# Altium schematic sheet PROC054D_AWR_1_AWR_4_LP87524P.SchDoc: AWR_1_AWR_4_LP87524P
size 558 x 431 mm; Date: Not shown in title block; ApprovedBy: Not shown in title block; CheckedBy: Not shown in title block; Author: Not shown in title block; CompanyName: Not shown in title block; DrawnBy: a0271760; Engineer: Not shown in title block; Organization: Not shown in title block; Address1: Not shown in title block; Address2: Not shown in title block; Address3: Not shown in title block; Address4: Not shown in title block; DocumentNumber: 4; Revision: Use project pAWRameter SCH_Rev; SheetNumber: 4; SheetTotal: 19; PageSetup: Record=PageOptions|CenterHorizontal=True|CenterVertical=True|PrintScale=1.00|XCorrection=1.00|YCorrection=1.00|PrintKind=0|BorderSize=5000000|LeftOffset=0|BottomOffset=0|Orientation=2|PaperLength=1000|PaperWidth=1000|Scale=100|PaperSource=15|PrintQuality=600|MediaType=1|DitherType=10|PaperKind=Letter|PrintScaleMode=1; CurrentTime: Not shown in title block; CurrentDate: Not shown in title block; Time: Not shown in title block; DocumentFullPathAndName: Not shown in title block; DocumentName: Not shown in title block; ModifiedDate: Not shown in title block; ImagePath: Not shown in title block
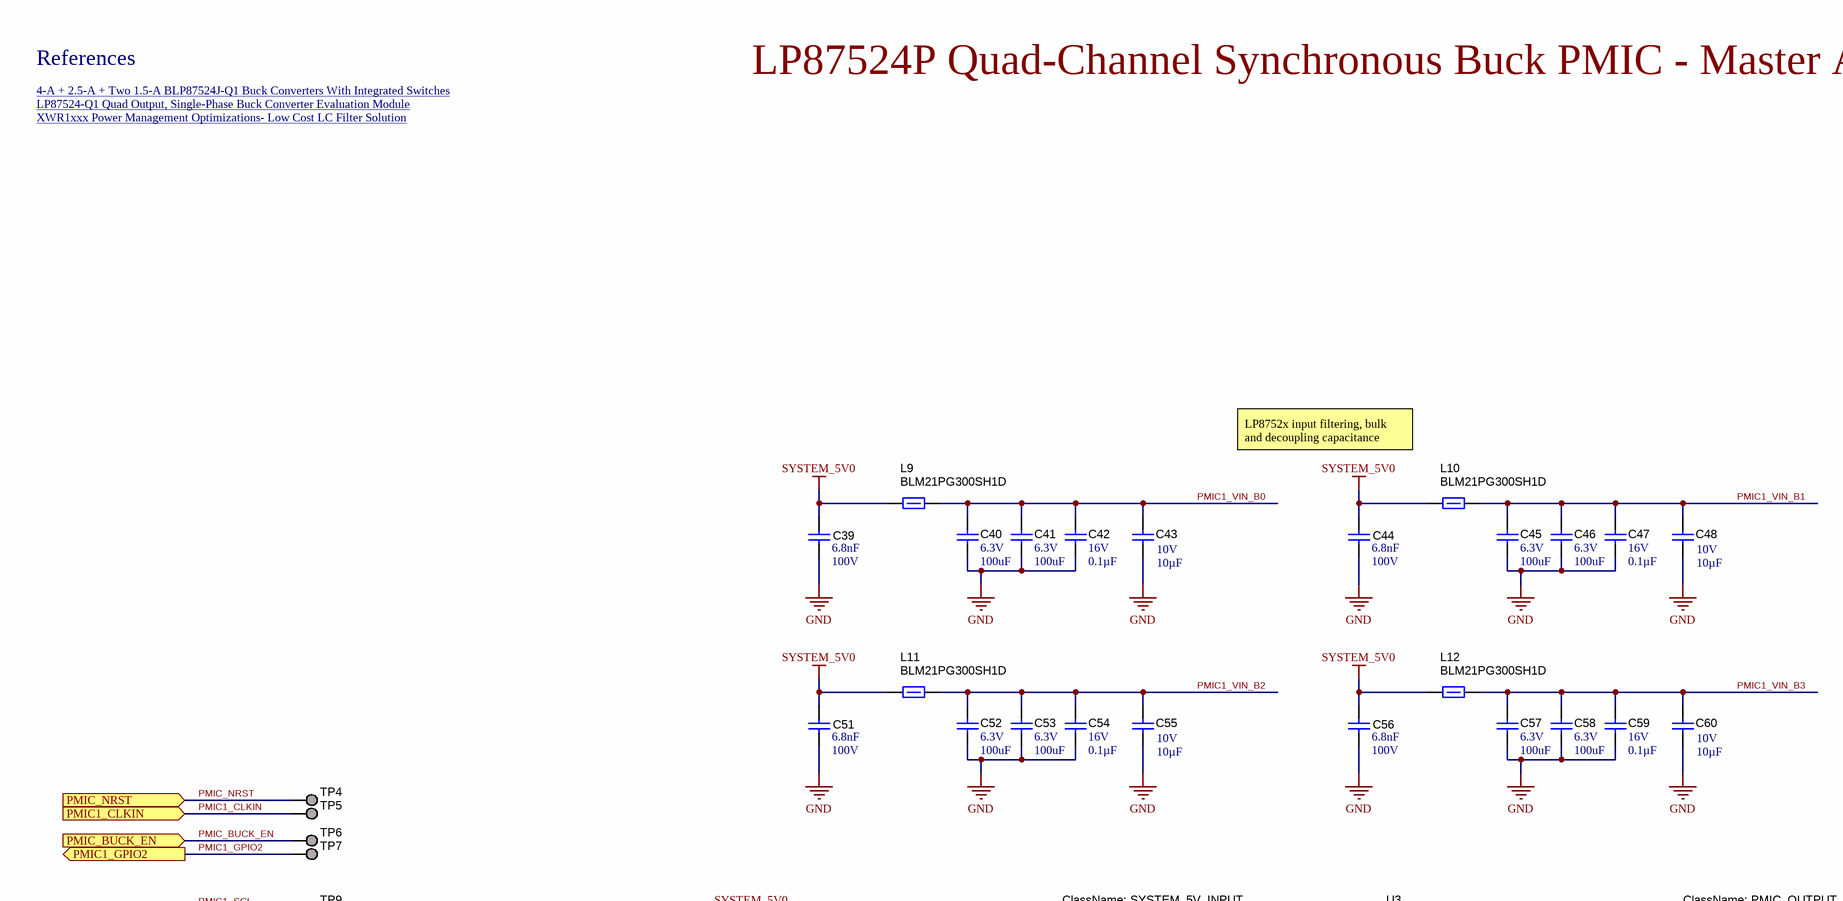
[diagram p0: PROC054D_AWR_1_AWR_4_LP87524P.SchDoc, top left]
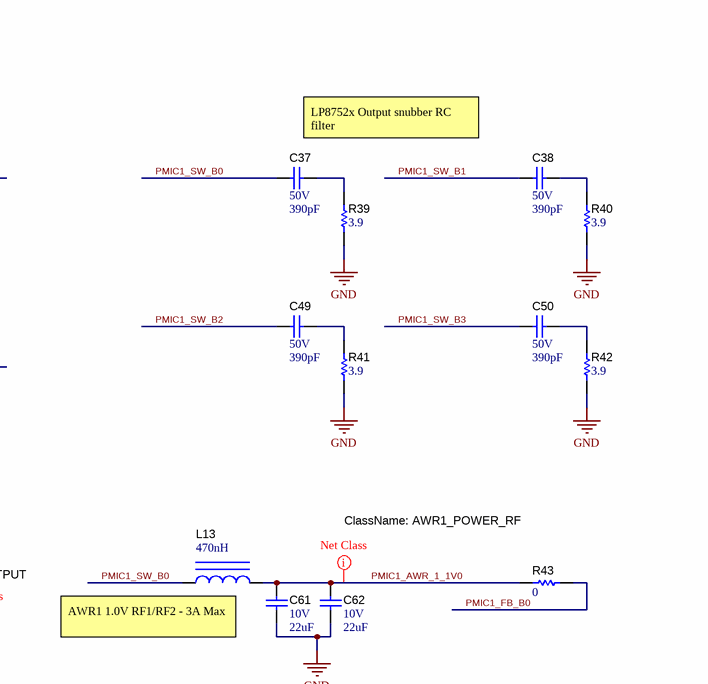
[diagram p1: PROC054D_AWR_1_AWR_4_LP87524P.SchDoc, top right]
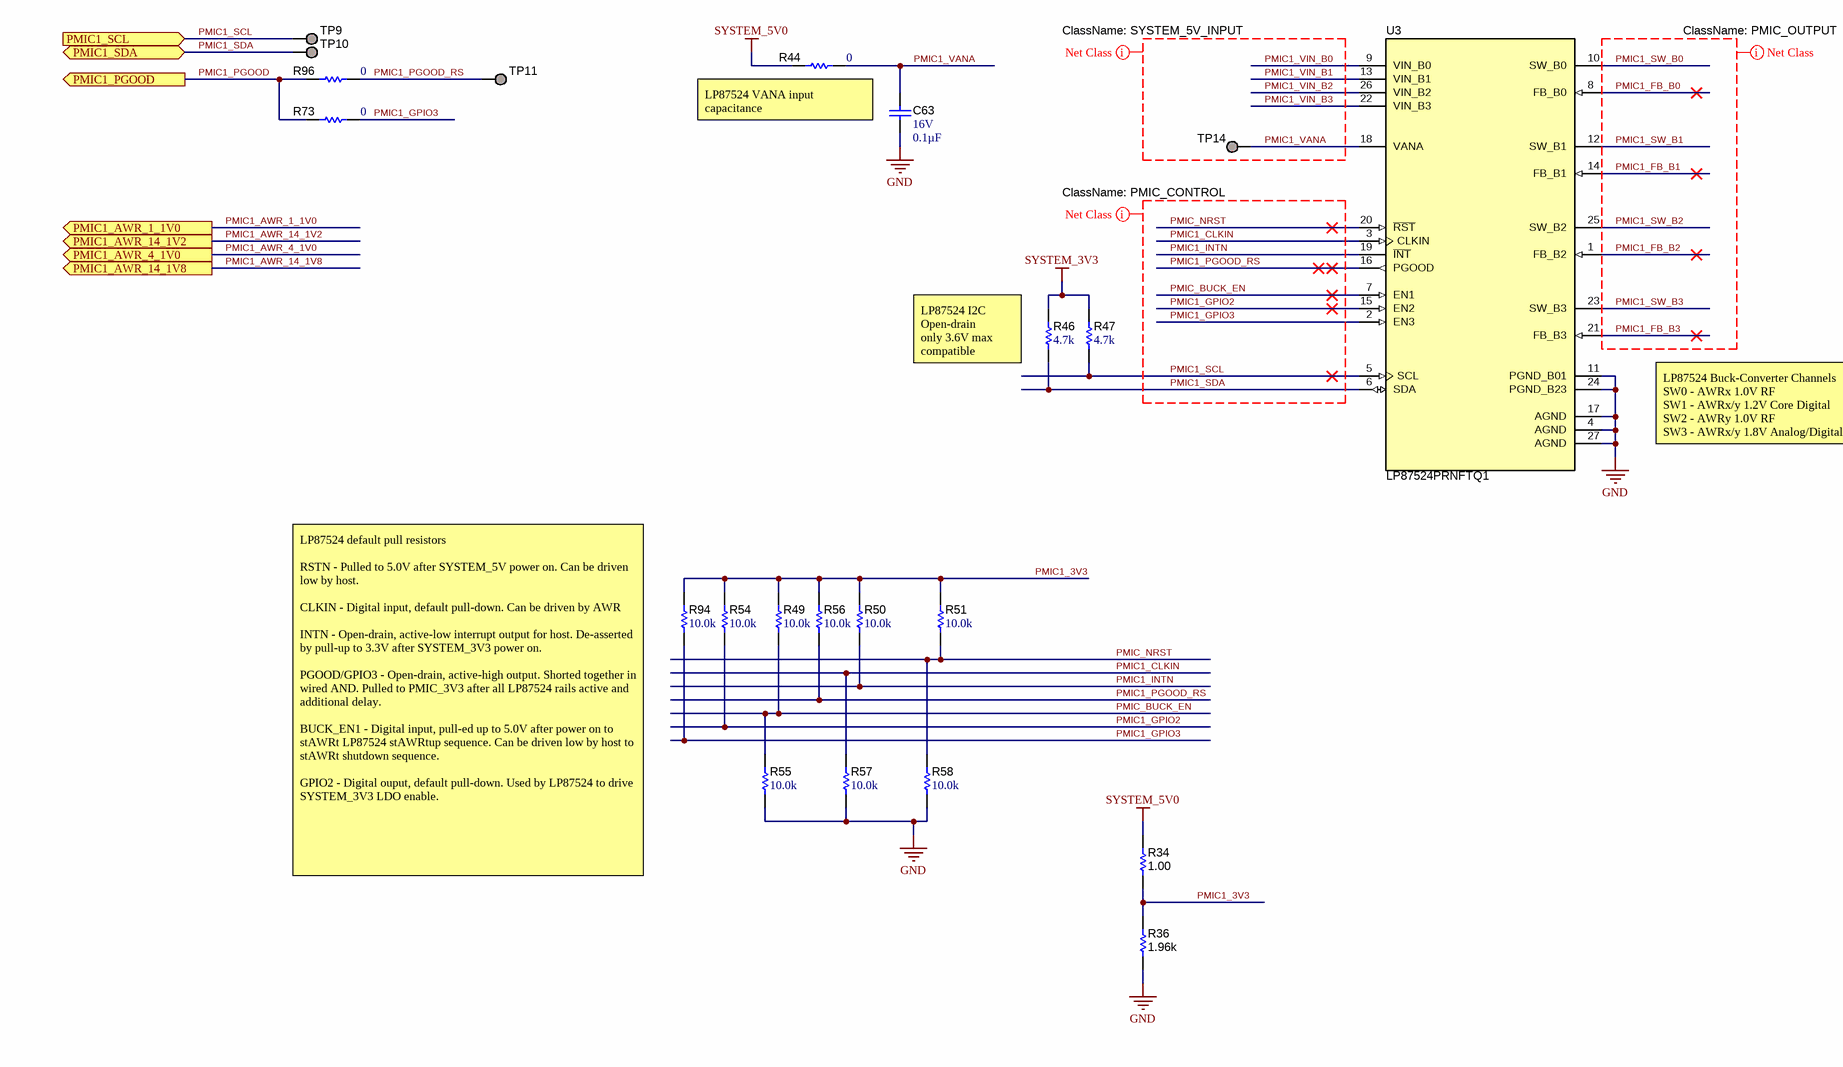
[diagram p2: PROC054D_AWR_1_AWR_4_LP87524P.SchDoc, bottom left]
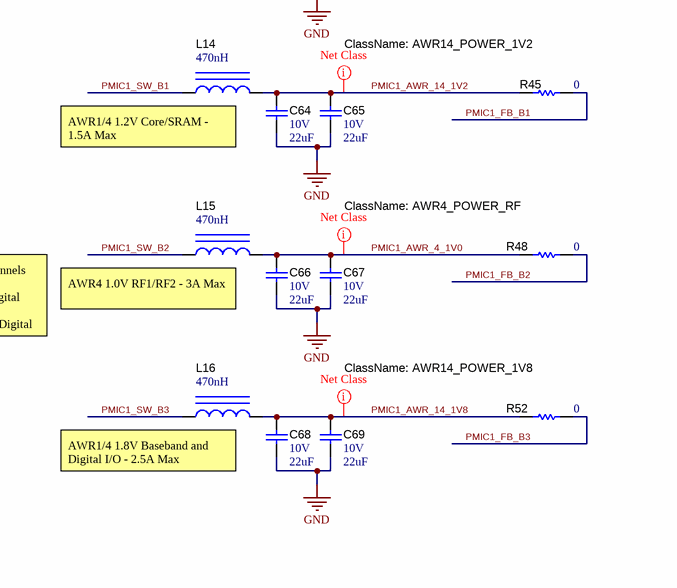
[diagram p3: PROC054D_AWR_1_AWR_4_LP87524P.SchDoc, bottom right]

## Parts
C37  VDC_V: 50V  ValueDisplayed: 390pF  [0402S]  (hidden comment: GCM155R71H391KA37D)
C38  VDC_V: 50V  ValueDisplayed: 390pF  [0402S]  (hidden comment: GCM155R71H391KA37D)
C39  Cap_F: 6.8nF  VDC_V: 100V  [0603S]  (hidden comment: GCM188R72A682KA37D)
C40  VDC_V: 6.3V  ValueDisplayed: 100uF  [0805L]  (hidden comment: GRM21BR60J107M)
C41  VDC_V: 6.3V  ValueDisplayed: 100uF  [0805L]  (hidden comment: GRM21BR60J107M)
C42  VDC_V: 16V  ValueDisplayed: 0.1µF  [0402S]  (hidden comment: GCM155R71C104JA55D)
C43  Cap_F: 10µF  VDC_V: 10V  [0805L]  (hidden comment: GRM21BR71A106KA73L)
C44  Cap_F: 6.8nF  VDC_V: 100V  [0603S]  (hidden comment: GCM188R72A682KA37D)
C45  VDC_V: 6.3V  ValueDisplayed: 100uF  [0805L]  (hidden comment: GRM21BR60J107M)
C46  VDC_V: 6.3V  ValueDisplayed: 100uF  [0805L]  (hidden comment: GRM21BR60J107M)
C47  VDC_V: 16V  ValueDisplayed: 0.1µF  [0402S]  (hidden comment: GCM155R71C104JA55D)
C48  Cap_F: 10µF  VDC_V: 10V  [0805L]  (hidden comment: GRM21BR71A106KA73L)
C49  VDC_V: 50V  ValueDisplayed: 390pF  [0402S]  (hidden comment: GCM155R71H391KA37D)
C50  VDC_V: 50V  ValueDisplayed: 390pF  [0402S]  (hidden comment: GCM155R71H391KA37D)
C51  Cap_F: 6.8nF  VDC_V: 100V  [0603S]  (hidden comment: GCM188R72A682KA37D)
C52  VDC_V: 6.3V  ValueDisplayed: 100uF  [0805L]  (hidden comment: GRM21BR60J107M)
C53  VDC_V: 6.3V  ValueDisplayed: 100uF  [0805L]  (hidden comment: GRM21BR60J107M)
C54  VDC_V: 16V  ValueDisplayed: 0.1µF  [0402S]  (hidden comment: GCM155R71C104JA55D)
C55  Cap_F: 10µF  VDC_V: 10V  [0805L]  (hidden comment: GRM21BR71A106KA73L)
C56  Cap_F: 6.8nF  VDC_V: 100V  [0603S]  (hidden comment: GCM188R72A682KA37D)
C57  VDC_V: 6.3V  ValueDisplayed: 100uF  [0805L]  (hidden comment: GRM21BR60J107M)
C58  VDC_V: 6.3V  ValueDisplayed: 100uF  [0805L]  (hidden comment: GRM21BR60J107M)
C59  VDC_V: 16V  ValueDisplayed: 0.1µF  [0402S]  (hidden comment: GCM155R71C104JA55D)
C60  Cap_F: 10µF  VDC_V: 10V  [0805L]  (hidden comment: GRM21BR71A106KA73L)
C61  VDC_V: 10V  ValueDisplayed: 22uF  [0805L]  (hidden comment: C2012X7S1A226M125AC)
C62  VDC_V: 10V  ValueDisplayed: 22uF  [0805L]  (hidden comment: C2012X7S1A226M125AC)
C63  VDC_V: 16V  ValueDisplayed: 0.1µF  [0402S]  (hidden comment: GCM155R71C104JA55D)
C64  VDC_V: 10V  ValueDisplayed: 22uF  [0805L]  (hidden comment: C2012X7S1A226M125AC)
C65  VDC_V: 10V  ValueDisplayed: 22uF  [0805L]  (hidden comment: C2012X7S1A226M125AC)
C66  VDC_V: 10V  ValueDisplayed: 22uF  [0805L]  (hidden comment: C2012X7S1A226M125AC)
C67  VDC_V: 10V  ValueDisplayed: 22uF  [0805L]  (hidden comment: C2012X7S1A226M125AC)
C68  VDC_V: 10V  ValueDisplayed: 22uF  [0805L]  (hidden comment: C2012X7S1A226M125AC)
C69  VDC_V: 10V  ValueDisplayed: 22uF  [0805L]  (hidden comment: C2012X7S1A226M125AC)
L9  BLM21PG300SH1D  [0805_HV]
L10  BLM21PG300SH1D  [0805_HV]
L11  BLM21PG300SH1D  [0805_HV]
L12  BLM21PG300SH1D  [0805_HV]
L13  ValueDisplayed: 470nH  [DFE252012P]  (hidden comment: DFE252012PD-R47M)
L14  ValueDisplayed: 470nH  [DFE252012P]  (hidden comment: DFE252012PD-R47M)
L15  ValueDisplayed: 470nH  [DFE252012P]  (hidden comment: DFE252012PD-R47M)
L16  ValueDisplayed: 470nH  [DFE252012P]  (hidden comment: DFE252012PD-R47M)
R34  ValueDisplayed: 1.00  [0603]  (hidden comment: CRCW06031R00FKEA)
R36  ValueDisplayed: 1.96k  [0603]  (hidden comment: CRCW06031K96FKEA)
R39  ValueDisplayed: 3.9  [0402S]  (hidden comment: CRCW04023R90JNED)
R40  ValueDisplayed: 3.9  [0402S]  (hidden comment: CRCW04023R90JNED)
R41  ValueDisplayed: 3.9  [0402S]  (hidden comment: CRCW04023R90JNED)
R42  ValueDisplayed: 3.9  [0402S]  (hidden comment: CRCW04023R90JNED)
R43  ValueDisplayed: 0  [0402S]  (hidden comment: CRCW04020000Z0ED)
R44  ValueDisplayed: 0  [0603S]  (hidden comment: MCT06030Z0000ZP500)
R45  ValueDisplayed: 0  [0402S]  (hidden comment: CRCW04020000Z0ED)
R46  ValueDisplayed: 4.7k  [0402]  (hidden comment: CRCW04024K70JNED)
R47  ValueDisplayed: 4.7k  [0402]  (hidden comment: CRCW04024K70JNED)
R48  ValueDisplayed: 0  [0402S]  (hidden comment: CRCW04020000Z0ED)
R49  ValueDisplayed: 10.0k  [0402]  (hidden comment: CRCW040210K0FKED)
R50  ValueDisplayed: 10.0k  [0402]  (hidden comment: CRCW040210K0FKED)
R51  ValueDisplayed: 10.0k  [0402]  (hidden comment: CRCW040210K0FKED)
R52  ValueDisplayed: 0  [0402S]  (hidden comment: CRCW04020000Z0ED)
R54  ValueDisplayed: 10.0k  [0402]  (hidden comment: CRCW040210K0FKED)
R55  ValueDisplayed: 10.0k  [0402]  (hidden comment: CRCW040210K0FKED)
R56  ValueDisplayed: 10.0k  [0402]  (hidden comment: CRCW040210K0FKED)
R57  ValueDisplayed: 10.0k  [0402]  (hidden comment: CRCW040210K0FKED)
R58  ValueDisplayed: 10.0k  [0402]  (hidden comment: CRCW040210K0FKED)
R73  ValueDisplayed: 0  [0603]  (hidden comment: MCT06030Z0000ZP500)
R94  ValueDisplayed: 10.0k  [0402]  (hidden comment: CRCW040210K0FKED)
R96  ValueDisplayed: 0  [0603]  (hidden comment: MCT06030Z0000ZP500)
TP4  TP_SM_1MM  [TP_SM_1MM]  (value not drawn)  (no BOM)
TP5  TP_SM_1MM  [TP_SM_1MM]  (value not drawn)  (no BOM)
TP6  TP_SM_1MM  [TP_SM_1MM]  (value not drawn)  (no BOM)
TP7  TP_SM_1MM  [TP_SM_1MM]  (value not drawn)  (no BOM)
TP9  TP_SM_1MM  [TP_SM_1MM]  (value not drawn)  (no BOM)
TP10  TP_SM_1MM  [TP_SM_1MM]  (value not drawn)  (no BOM)
TP11  TP_SM_1MM  [TP_SM_1MM]  (value not drawn)  (no BOM)
TP14  TP_SM_1MM  [TP_SM_1MM]  (value not drawn)  (no BOM)
U3  LP87524PRNFTQ1  [RNF0026C]

## Ports
PMIC1_AWR_1_1V0 (out), PMIC1_AWR_4_1V0 (out), PMIC1_AWR_14_1V2 (out), PMIC1_AWR_14_1V8 (out), PMIC1_CLKIN (in), PMIC1_GPIO2 (out), PMIC1_PGOOD (out), PMIC1_SCL (in), PMIC1_SDA (bidir), PMIC_BUCK_EN (in), PMIC_NRST (in)

## Nets
GND: C39.2 C40.2 C41.2 C42.2 C43.2 C44.2 C45.2 C46.2 C47.2 C48.2 C51.2 C52.2 C53.2 C54.2 C55.2 C56.2 C57.2 C58.2 C59.2 C60.2 C61.2 C62.2 C63.2 C64.2 C65.2 C66.2 C67.2 C68.2 C69.2 R36.1 R39.1 R40.1 R41.1 R42.1 R55.1 R57.1 R58.1 U3.4(AGND) U3.11(PGND_B01) U3.17(AGND) U3.24(PGND_B23) U3.27(AGND)
SYSTEM_3V3: R46.1 R47.2
SYSTEM_5V0: C39.1 C44.1 C51.1 C56.1 L9.1 L10.1 L11.1 L12.1 R34.2 R44.1
PMIC1_3V3: R34.1 R36.2 R49.2 R50.2 R51.2 R54.2 R56.2 R94.2
PMIC1_AWR_1_1V0: C61.1 C62.1 L13.2 R43.1 ; port PMIC1_AWR_1_1V0
PMIC1_AWR_4_1V0: C66.1 C67.1 L15.2 R48.1 ; port PMIC1_AWR_4_1V0
PMIC1_AWR_14_1V2: C64.1 C65.1 L14.2 R45.1 ; port PMIC1_AWR_14_1V2
PMIC1_AWR_14_1V8: C68.1 C69.1 L16.2 R52.1 ; port PMIC1_AWR_14_1V8
PMIC1_CLKIN: R57.2 TP5.1 U3.3(CLKIN) ; port PMIC1_CLKIN
PMIC1_FB_B0: R43.2 U3.8(FB_B0)
PMIC1_FB_B1: R45.2 U3.14(FB_B1)
PMIC1_FB_B2: R48.2 U3.1(FB_B2)
PMIC1_FB_B3: R52.2 U3.21(FB_B3)
PMIC1_GPIO2: R54.1 TP7.1 U3.15(EN2) ; port PMIC1_GPIO2
PMIC1_GPIO3: R73.2 R94.1 U3.2(EN3)
PMIC1_INTN: R50.1 U3.19(~{INT})
PMIC1_PGOOD: R73.1 R96.1 ; port PMIC1_PGOOD
PMIC1_PGOOD_RS: R56.1 R96.2 TP11.1 U3.16(PGOOD)
PMIC1_SCL: R47.1 TP9.1 U3.5(SCL) ; port PMIC1_SCL
PMIC1_SDA: R46.2 TP10.1 U3.6(SDA) ; port PMIC1_SDA
PMIC1_SW_B0: C37.1 L13.1 U3.10(SW_B0)
PMIC1_SW_B1: C38.1 L14.1 U3.12(SW_B1)
PMIC1_SW_B2: C49.1 L15.1 U3.25(SW_B2)
PMIC1_SW_B3: C50.1 L16.1 U3.23(SW_B3)
PMIC1_VANA: C63.1 R44.2 TP14.1 U3.18(VANA)
PMIC1_VIN_B0: C40.1 C41.1 C42.1 C43.1 L9.2 U3.9(VIN_B0)
PMIC1_VIN_B1: C45.1 C46.1 C47.1 C48.1 L10.2 U3.13(VIN_B1)
PMIC1_VIN_B2: C52.1 C53.1 C54.1 C55.1 L11.2 U3.26(VIN_B2)
PMIC1_VIN_B3: C57.1 C58.1 C59.1 C60.1 L12.2 U3.22(VIN_B3)
PMIC_BUCK_EN: R49.1 R55.2 TP6.1 U3.7(EN1) ; port PMIC_BUCK_EN
PMIC_NRST: R51.1 R58.2 TP4.1 U3.20(~{RST}) ; port PMIC_NRST
NetC37_2: C37.2 R39.2
NetC38_2: C38.2 R40.2
NetC49_2: C49.2 R41.2
NetC50_2: C50.2 R42.2

## Layout directives
net class SYSTEM_5V_INPUT: PMIC1_VANA, PMIC1_VIN_B0, PMIC1_VIN_B1, PMIC1_VIN_B2, PMIC1_VIN_B3
net class PMIC_CONTROL: PMIC1_CLKIN, PMIC1_GPIO2, PMIC1_GPIO3, PMIC1_INTN, PMIC1_PGOOD_RS, PMIC1_SCL, PMIC1_SDA, PMIC_BUCK_EN, PMIC_NRST
net class PMIC_OUTPUT: PMIC1_FB_B0, PMIC1_FB_B1, PMIC1_FB_B2, PMIC1_FB_B3, PMIC1_SW_B0, PMIC1_SW_B1, PMIC1_SW_B2, PMIC1_SW_B3
net class AWR14_POWER_1V2: PMIC1_AWR_14_1V2
net class AWR14_POWER_1V8: PMIC1_AWR_14_1V8
net class AWR1_POWER_RF: PMIC1_AWR_1_1V0
net class AWR4_POWER_RF: PMIC1_AWR_4_1V0

## Notes on the sheet
- References
- LP87524P Quad-Channel Synchronous Buck PMIC - Master AWR_1 and Slave AWR_4
- LP87524-Q1 Quad Output, Single-Phase Buck Converter Evaluation Module <http://www.ti.com/tool/lp87524q1evm>
- XWR1xxx Power Management Optimizations- Low Cost LC Filter Solution <http://www.ti.com/lit/pdf/swra577>
- 4-A + 2.5-A + Two 1.5-A BLP87524J-Q1 Buck Converters With Integrated Switches <http://www.ti.com/product/lp87524j-q1>
- LP8752x input filtering, bulk and decoupling capacitance
- (near C37) LP8752x Output snubber RC filter
- (near L13) AWR1 1.0V RF1/RF2 - 3A Max
- (near R44) LP87524 VANA input capacitance
- (near L14) AWR1/4 1.2V Core/SRAM - 1.5A Max
- (near R46) LP87524 I2C
  Open-drain
  only 3.6V max compatible
- (near L15) AWR4 1.0V RF1/RF2 - 3A Max
- LP87524 Buck-Converter Channels
  SW0 - AWRx 1.0V RF
  SW1 - AWRx/y 1.2V Core Digital
  SW2 - AWRy 1.0V RF
  SW3 - AWRx/y 1.8V Analog/Digital
- (near L16) AWR1/4 1.8V Baseband and Digital I/O - 2.5A Max
- (near R94) LP87524 default pull resistors
  RSTN - Pulled to 5.0V after SYSTEM_5V power on. Can be driven low by host.
  CLKIN - Digital input, default pull-down. Can be driven by AWR
  INTN - Open-drain, active-low interrupt output for host. De-asserted by pull-up to 3.3V after SYSTEM_3V3 power on.
  PGOOD/GPIO3 - Open-drain, active-high output. Shorted together in wired AND. Pulled to PMIC_3V3 after all LP87524 rails active and additional delay.
  BUCK_EN1 - Digital input, pull-ed up to 5.0V after power on to stAWRt LP87524 stAWRtup sequence. Can be driven low by host to stAWRt shutdown sequence.
  GPIO2 - Digital ouput, default pull-down. Used by LP87524 to drive SYSTEM_3V3 LDO enable.
- Drawn By:
- SVN Rev:
- Number:
- TID #:
- Orderable:
- Rev:
- Sheet Title:
- File:
- Project Title:
- Designed for:
- Assembly VAWRiant:
- Mod. Date:
- Sheet:
- Size:
- of
- C
- http://www.ti.com
- Texas Instruments and/or its licensors do not wAWRrant the accuracy or completeness of this specification or any information contained therein. Texas Instruments and/or its licensors do not wAWRrant that this design will meet the specifications, will be suitable for your application or fit for any pAWRticulAWR purpose, or will operate in an implementation. Texas Instruments and/or its licensors do not wAWRrant that the design is production worthy. You should completely validate and test your design implementation to confirm the system functionality for your application.
- Engineer:
- Contact:
- © Texas Instruments

## Library data of the parts
C37 C38 C49 C50 = CMP-0080703-2: CAP, CERM, 390 pF, 50 V,+/- 10%, X7R, AEC-Q200 Grade 1, 0402; Manufacturer: MuRata; Cap_Case: 0402; SizeX_mm: 1; SizeZ_mm: 0.6; SizeY_mm: 0.5; AEC Qualified: Y; Value: 390pF; Polarized: N; AEC Category: Q200; TaMax_C: 125°C; TaMin_C: -55°C; SizeAreaWB_mm2: 3; U/M: EA; CompType: Capacitor; MountType: SMT; Supplier Part Number 1: 81-GCM155R71H391KA7D; PackageReference: 0402; RoHS: Y; ComponentLink1URL: https://search.murata.co.jp/Ceramy/image/img/A01X/G101/ENG/GCM155R71H391KA37-01.pdf; Tolerance_%: 10%; Supplier 1: Mouser; AEC Grade: 1; Value2: 50V; PartNumber: GCM155R71H391KA37D; Cap_F: 390pF; TempCo: X7R; Technology: Ceramic; ComponentLink1Description: Datasheet link; SizeArea_mm2: 0.5
C39 C44 C51 C56 = CMP-0860888-1: CAP, CERM, 6800 pF, 100 V,+/- 10%, X7R, AEC-Q200 Grade 1, 0603; Manufacturer: MuRata; AEC Grade: 1; AEC Qualified: Y; TaMin_C: -55°C; AEC Category: Q200; SizeY_mm: 0.8; Cap_Case: 0603; ValueDisplayed: 6800pF; Polarized: N; SizeArea_mm2: 1.28; U/M: EA; SizeX_mm: 1.6; SizeAreaWB_mm2: 4.68; TaMax_C: 125°C; Value: 6800pF; Tolerance_%: 10%; RoHS: Y; ComponentLink1URL: https://www.murata.com/~/media/webrenewal/support/library/catalog/products/capacitor/mlcc/c03e.ashx?la=en-us; SizeZ_mm: 1; PackageReference: 0603; TempCo: X7R; CompType: Capacitor; Value2: 100V; PartNumber: GCM188R72A682KA37D; MountType: SMT; Technology: Ceramic; ComponentLink1Description: Datasheet link
C40 C41 = CMP-0008280-2: CAP, CERM, 100 uF, 6.3 V, +/- 20%, X5R, 0805; Manufacturer: MuRata; TaMin_C: -55°C; Polarized: N; SizeAreaWB_mm2: 6.75; Value1: Unknown; U/M: EA; Value: 100uF; TaMax_C: 85°C; SizeZ_mm: 1.45; SizeX_mm: 2; SizeY_mm: 1.25; Cap_Case: 0805; SizeArea_mm2: 2.5; CompType: Capacitor; Cap_F: 100µF; AEC Category: Q200; Publisher: Texas Instruments; TempCo: X5R; Published: 2008-06-19; MountType: SMT; PackageReference: 0805; Tolerance_%: 20%; Value2: 6.3V; LatestRevisionDate: 2017-03-09; PartNumber: GRM21BR60J107M; AEC Qualified: ?; ComponentLink1Description: Datasheet link; Technology: Ceramic; ComponentLink1URL: https://sps06.itg.ti.com/sites/KMS/crossdivteams/altium/docs/ComponentDatasheets/100uF_6p3V_0805_GRM21BR60J107M.pdf
C42 C63 = CMP-0080702-1: CAP, CERM, 0.1 µF, 16 V,+/- 5%, X7R, AEC-Q200 Grade 1, 0402; Manufacturer: MuRata; Cap_F: 100nF; SizeAreaWB_mm2: 3; SizeArea_mm2: 0.5; AEC Qualified: Y; AEC Category: Q200; Value: 0.1uF; TaMax_C: 125°C; SizeZ_mm: 0.6; AEC Grade: 1; Polarized: N; TaMin_C: -55°C; U/M: EA; CompType: Capacitor; Cap_Case: 0402; ComponentLink1Description: Datasheet link; RoHS: Y; Tolerance_%: 5%; Supplier 1: Digi-Key; PackageReference: 0402; Technology: Ceramic; PartNumber: GCM155R71C104JA55D; TempCo: X7R; Supplier Part Number 2: 81-GCM155R71C104JA5D; Supplier 2: Mouser; SizeY_mm: 0.5; Value2: 16V; ComponentLink1URL: https://search.murata.co.jp/Ceramy/image/img/A01X/G101/ENG/GCM155R71C104JA55-01.pdf; MountType: SMT; Supplier Part Number 1: 490-16433-1-ND; SizeX_mm: 1
C43 C48 C55 C60 = CMP-0081849-1: CAP, CERM, 10 µF,  V,+/- 10%, X7R, 0805; Manufacturer: MuRata; TaMin_C: -55°C; Polarized: N; Green_Lifecycle: Active; SizeAreaWB_mm2: 6.75; Green_REACh: Passed; U/M: EA; Value: 10uF; TaMax_C: 125°C; SizeZ_mm: 1.45; SizeX_mm: 2; SizeY_mm: 1.25; Cap_Case: 0805; SizeArea_mm2: 2.5; AEC Category: Q200; ComponentLink1URL: https://search.murata.co.jp/Ceramy/image/img/A01X/G101/ENG/GRM21BR71A106KA73-01.pdf; Supplier Part Number 2: 81-GRM21BR71A106KA3L; Supplier 2: Mouser; TempCo: X7R; RoHS: Y; MountType: SMT; Green_EU RoHS-2: Incomplete; Supplier 1: Digi-Key; Green_EU RoHS: Passed; PackageReference: 0805; Tolerance_%: 10%; CompType: Capacitor; PartNumber: GRM21BR71A106KA73L; AEC Qualified: N; ComponentLink1Description: Datasheet link; AEC Grade: N/A; Supplier Part Number 1: 490-10516-2-ND; Technology: Ceramic; ValueDisplayed: 10µF
C45 C46 C52 C53 C57 C58 = CMP-0008280-2: CAP, CERM, 100 uF, 6.3 V, +/- 20%, X5R, 0805; Manufacturer: MuRata; TaMin_C: -55°C; Polarized: N; SizeAreaWB_mm2: 6.75; Value1: Unknown; U/M: EA; Value: 100uF; TaMax_C: 85°C; SizeZ_mm: 1.45; SizeX_mm: 2; SizeY_mm: 1.25; Cap_Case: 0805; SizeArea_mm2: 2.5; Cap_F: 100µF; AEC Category: Q200; Publisher: Texas Instruments; TempCo: X5R; Published: 2008-06-19; MountType: SMT; PackageReference: 0805; Tolerance_%: 20%; Value2: 6.3V; CompType: Capacitor; LatestRevisionDate: 2017-03-09; PartNumber: GRM21BR60J107M; AEC Qualified: ?; ComponentLink1Description: Datasheet link; Technology: Ceramic; ComponentLink1URL: https://sps06.itg.ti.com/sites/KMS/crossdivteams/altium/docs/ComponentDatasheets/100uF_6p3V_0805_GRM21BR60J107M.pdf
C47 C54 C59 = CMP-0080702-1: CAP, CERM, 0.1 µF, 16 V,+/- 5%, X7R, AEC-Q200 Grade 1, 0402; Manufacturer: MuRata; Cap_F: 100nF; SizeAreaWB_mm2: 3; SizeArea_mm2: 0.5; AEC Qualified: Y; AEC Category: Q200; Value: 0.1uF; TaMax_C: 125°C; SizeZ_mm: 0.6; AEC Grade: 1; Polarized: N; TaMin_C: -55°C; U/M: EA; Cap_Case: 0402; ComponentLink1Description: Datasheet link; RoHS: Y; Tolerance_%: 5%; Supplier 1: Digi-Key; PackageReference: 0402; Technology: Ceramic; PartNumber: GCM155R71C104JA55D; TempCo: X7R; Supplier Part Number 2: 81-GCM155R71C104JA5D; Supplier 2: Mouser; SizeY_mm: 0.5; Value2: 16V; ComponentLink1URL: https://search.murata.co.jp/Ceramy/image/img/A01X/G101/ENG/GCM155R71C104JA55-01.pdf; CompType: Capacitor; MountType: SMT; Supplier Part Number 1: 490-16433-1-ND; SizeX_mm: 1
C61 C62 C64-C69 = CMP-0007890-1: CAP, CERM, 22 uF, 10 V, +/- 20%, X7S, 0805; Manufacturer: TDK; TaMin_C: -55°C; ESR_ohm: 2.05m; Polarized: N; SizeAreaWB_mm2: 6.75; Value1: 0.00205 ohm; U/M: EA; Value: 22uF; TaMax_C: 125°C; SizeZ_mm: 1.45; SizeX_mm: 2; SizeY_mm: 1.25; Cap_Case: 0805; SizeArea_mm2: 2.5; Cap_F: 22µF; IRMS_A: 4.5559A; AEC Category: Q200; ComponentLink1URL: https://product.tdk.com/en/search/capacitor/ceramic/mlcc/info?part_no=C2012X7S1A226M125AC; Supplier Part Number 2: 05X9251; Publisher: Texas Instruments; Supplier 2: Newark; TempCo: X7S; Published: 2008-06-19; RoHS: Y; MountType: SMT; Supplier 1: Digi-Key; PackageReference: 0805; Tolerance_%: 20%; Value2: 10V; CompType: Capacitor; LatestRevisionDate: 2017-03-09; PartNumber: C2012X7S1A226M125AC; AEC Qualified: N; ComponentLink1Description: Datasheet link; AEC Grade: N/A; Supplier Part Number 1: 445-14560-1-ND; Technology: Ceramic
L9-L12 = CMP-0003364-1: Ferrite Bead, 30 ohm @ 100 MHz, 4 A, 0805; Manufacturer: MuRata; ZTyp@100MHz_Ohm: 30; SizeAreaWB_mm2: 6.75; DCR_ohm: 0.014; Value1: 0.014 ohm; Value: 30 ohm; Imax_A: 4A; SizeZ_mm: 1.45; SizeX_mm: 2; SizeY_mm: 1.25; SizeArea_mm2: 2.5; ComponentLink1URL: http://www.murata.com/en-us/api/pdfdownloadapi?cate=luNoiseSupprFilteChipFerriBead&partno=BLM21PG300SH1%23; Supplier Part Number 2: 87X8590; Publisher: Texas Instruments; Supplier 2: Newark; Supplier Part Number 3: 81-BLM21PG300SH1D; Supplier 3: Mouser; Published: 2014-04-30; RoHS: Y; MountType: SMT; Supplier 1: Digi-Key; PackageReference: 0805; Value2: 4A; CompType: Ferrite Bead; LatestRevisionDate: 2017-03-09; PartNumber: BLM21PG300SH1D; ComponentLink1Description: Datasheet link; Supplier Part Number 1: 490-11049-1-ND; ValueDisplayed: 30 ohm
L13-L16 = CMP-0058944-1: Inductor, Shielded, 470 nH, 4.7 A, 0.021 ohm, SMD; Manufacturer: MuRata Toko; Isat: 6.1A @ 30% inductance drop; Irms: 4.7A @ 40C rise; SizeAreaWB_mm2: 10.5; DCR_ohm: 0.021; Value: 470nH; Imax_A: 4.7A; SizeZ_mm: 1.2; SizeX_mm: 2.5; SizeY_mm: 2; SizeArea_mm2: 5; AEC Category: Q200; ComponentLink1URL: https://sps06.itg.ti.com/sites/KMS/crossdivteams/altium/docs/ComponentDatasheets/DFE252012PD_Catalouge_20140701 with AEC-Q200.pdf; Publisher: Texas Instruments; Published: 2008-06-26; RoHS: Y; Value1: 0.021 ohm; Material: ?; MountType: SMT; PackageReference: 1008; Value2: 4.7A; CompType: Inductor; Ind_H: 470nH; LatestRevisionDate: 2017-06-02; PartNumber: DFE252012PD-R47M; AEC Qualified: ?; ComponentLink1Description: Datasheet link; Technology: Shielded
R34 = CMP-0022170-4: RES, 1.00, 1%, 0.1 W, AEC-Q200 Grade 0, 0603; Manufacturer: Vishay-Dale; Power_W: 100mW; TempCo: 100 ppm/C; Value_Code: 1R00; Value: 1.00; EIA_Code: E96; Res_ohm: 1; SizeX_mm: 1.6; SizeY_mm: 0.8; Value2: 0.1W; SizeArea_mm2: 1.28; AEC Qualified: Y; VDC_V: 75V; AEC Category: Q200; AEC Grade: 0; Supplier Part Number 2: 71-CRCW06031R00FKEA; Supplier 2: Mouser; Supplier Part Number 3: 1616871; Supplier 3: Farnell; RoHS: E; Value1: 1%; MountType: SMT; Supplier 1: Newark; PackageReference: 0603; Tolerance_%: 1%; SizeZ_mm: 1; CompType: Resistor; PartNumber: CRCW06031R00FKEA; ComponentLink1Description: Datasheet link; Supplier Part Number 1: 52K8059; Technology: Thick Film; ComponentLink1URL: http://www.vishay.com/docs/20035/dcrcwe3.pdf
R36 = CMP-0022137-4: RES, 1.96 k, 1%, 0.1 W, AEC-Q200 Grade 0, 0603; Manufacturer: Vishay-Dale; Power_W: 100mW; TempCo: 100 ppm/C; Value_Code: 1k96; Value: 1.96k; EIA_Code: E96; SizeX_mm: 1.6; SizeY_mm: 0.8; SizeZ_mm: 1; Value2: 0.1W; SizeArea_mm2: 1.28; AEC Qualified: Y; VDC_V: 75V; AEC Category: Q200; AEC Grade: 0; Supplier Part Number 2: 52K8051; Supplier 2: Newark; Supplier Part Number 3: 71-CRCW0603-1.96K-E3; Supplier 3: Mouser; RoHS: E; Value1: 1%; MountType: SMT; Supplier 1: Digi-Key; PackageReference: 0603; Tolerance_%: 1%; Res_ohm: 1.96k; CompType: Resistor; PartNumber: CRCW06031K96FKEA; ComponentLink1Description: Datasheet link; Supplier Part Number 1: 541-1.96KHCT-ND; Technology: Thick Film; ComponentLink1URL: http://www.vishay.com/docs/20035/dcrcwe3.pdf
R39 = CMP-0026928-3: RES, 3.9, 5%, 0.063 W, AEC-Q200 Grade 0, 0402; Manufacturer: Vishay-Dale; Power_W: 63mW; TempCo: 200 ppm/C; Value_Code: 3R90; Value: 3.9; EIA_Code: E24; SizeX_mm: 1; SizeY_mm: 0.5; SizeZ_mm: 0.6; Value2: 0.063W; CompType: Resistor; AEC Qualified: Y; VDC_V: 50V; AEC Category: Q200; AEC Grade: 0; Supplier Part Number 2: 71-CRCW0402J-3.9-E3; Supplier 2: Mouser; Supplier Part Number 3: 1739061; Supplier 3: Farnell; RoHS: E; Value1: 5%; MountType: SMT; Supplier 1: Digi-Key; PackageReference: 0402; Tolerance_%: 5%; Res_ohm: 3.9; SizeArea_mm2: 0.5; PartNumber: CRCW04023R90JNED; ComponentLink1Description: Datasheet link; Supplier Part Number 1: 541-3.9JCT-ND; Technology: Thick Film; ComponentLink1URL: http://www.vishay.com/docs/20035/dcrcwe3.pdf
R40-R42 = CMP-0026928-3: RES, 3.9, 5%, 0.063 W, AEC-Q200 Grade 0, 0402; Manufacturer: Vishay-Dale; Power_W: 63mW; TempCo: 200 ppm/C; Value_Code: 3R90; Value: 3.9; EIA_Code: E24; SizeX_mm: 1; SizeY_mm: 0.5; SizeZ_mm: 0.6; Value2: 0.063W; AEC Qualified: Y; VDC_V: 50V; AEC Category: Q200; AEC Grade: 0; Supplier Part Number 2: 71-CRCW0402J-3.9-E3; Supplier 2: Mouser; Supplier Part Number 3: 1739061; Supplier 3: Farnell; RoHS: E; Value1: 5%; MountType: SMT; Supplier 1: Digi-Key; PackageReference: 0402; Tolerance_%: 5%; Res_ohm: 3.9; SizeArea_mm2: 0.5; CompType: Resistor; PartNumber: CRCW04023R90JNED; ComponentLink1Description: Datasheet link; Supplier Part Number 1: 541-3.9JCT-ND; Technology: Thick Film; ComponentLink1URL: http://www.vishay.com/docs/20035/dcrcwe3.pdf
R43 R45 R48 R52 = CMP-0026822-3: RES, 0, 5%, 0.063 W, AEC-Q200 Grade 0, 0402; Manufacturer: Vishay-Dale; Power_W: 63mW; TempCo: 200 ppm/C; Value_Code: 0000; Value: 0; EIA_Code: E24; SizeX_mm: 1; SizeY_mm: 0.5; SizeZ_mm: 0.6; Value2: 0.063W; AEC Qualified: Y; VDC_V: 50V; AEC Category: Q200; Supplier Part Number 2: 52K6543; Supplier 2: Newark; Supplier Part Number 3: 71-CRCW0402-0-E3; Supplier 3: Mouser; RoHS: E; Value1: 5%; MountType: SMT; Supplier 1: Digi-Key; PackageReference: 0402; Tolerance_%: 5%; Res_ohm: 0; SizeArea_mm2: 0.5; CompType: Resistor; PartNumber: CRCW04020000Z0ED; ComponentLink1Description: Datasheet link; Supplier Part Number 1: 541-0.0JCT-ND; Technology: Thick Film; ComponentLink1URL: http://www.vishay.com/docs/20035/dcrcwe3.pdf; AEC Grade: 0
R44 = CMP-0025884-3: RES, 0, 5%, 0.125 W, 0603; Manufacturer: Vishay/Beyschlag; Power_W: 125mW; TempCo: ppm/C; Value_Code: 0000; U/M: EA; Value: 0; EIA_Code: E24; SizeX_mm: 1.6; SizeY_mm: 0.8; SizeZ_mm: 1; Value2: 0.125W; SizeArea_mm2: 1.28; CompType: Resistor; AEC Qualified: N; AEC Category: Q200; Supplier Part Number 2: 96Y9454; Publisher: Texas Instruments; Supplier 2: Newark; Supplier Part Number 3: 594-MCT06030Z0000ZP5; Supplier 3: Mouser; Published: 2008-06-26; RoHS: Y; Value1: 5%; MountType: SMT; Supplier 1: Digi-Key; PackageReference: 0603; Tolerance_%: 5%; Res_ohm: 0; LatestRevisionDate: 2017-03-09; PartNumber: MCT06030Z0000ZP500; ComponentLink1Description: Datasheet link; AEC Grade: N/A; Supplier Part Number 1: MCT0603-0.0-ZZCT-ND; Technology: Thin Film; ComponentLink1URL: http://www.vishay.com/docs/28705/mcx0x0xpro.pdf
R46 = CMP-0026938-5: RES, 4.7 k, 5%, 0.063 W, AEC-Q200 Grade 0, 0402; Manufacturer: Vishay-Dale; Power_W: 63mW; TempCo: 200 ppm/C; Value_Code: 4k70; Value: 4.7k; EIA_Code: E24; SizeX_mm: 1; SizeY_mm: 0.5; SizeZ_mm: 0.6; Value2: 0.063W; CompType: Resistor; AEC Qualified: Y; VDC_V: 50V; AEC Category: Q200; AEC Grade: 0; Supplier Part Number 2: 59M6733; Supplier 2: Newark; Supplier Part Number 3: 71-CRCW0402J-4.7K-E3; Supplier 3: Mouser; RoHS: E; Value1: 5%; MountType: SMT; Supplier 1: Digi-Key; PackageReference: 0402; Tolerance_%: 5%; Res_ohm: 4.7k; SizeArea_mm2: 0.5; PartNumber: CRCW04024K70JNED; ComponentLink1Description: Datasheet link; Supplier Part Number 1: 541-4.7KJCT-ND; Technology: Thick Film; ComponentLink1URL: http://www.vishay.com/docs/20035/dcrcwe3.pdf
R47 = CMP-0026938-5: RES, 4.7 k, 5%, 0.063 W, AEC-Q200 Grade 0, 0402; Manufacturer: Vishay-Dale; Power_W: 63mW; TempCo: 200 ppm/C; Value_Code: 4k70; Value: 4.7k; EIA_Code: E24; SizeX_mm: 1; SizeY_mm: 0.5; SizeZ_mm: 0.6; Value2: 0.063W; AEC Qualified: Y; VDC_V: 50V; AEC Category: Q200; AEC Grade: 0; Supplier Part Number 2: 59M6733; Supplier 2: Newark; Supplier Part Number 3: 71-CRCW0402J-4.7K-E3; Supplier 3: Mouser; RoHS: E; Value1: 5%; MountType: SMT; Supplier 1: Digi-Key; PackageReference: 0402; Tolerance_%: 5%; Res_ohm: 4.7k; SizeArea_mm2: 0.5; CompType: Resistor; PartNumber: CRCW04024K70JNED; ComponentLink1Description: Datasheet link; Supplier Part Number 1: 541-4.7KJCT-ND; Technology: Thick Film; ComponentLink1URL: http://www.vishay.com/docs/20035/dcrcwe3.pdf
R49-R51 R54-R58 R94 = CMP-0025958-3: RES, 10.0 k, 1%, 0.063 W, AEC-Q200 Grade 0, 0402; Manufacturer: Vishay-Dale; Power_W: 63mW; TempCo: 100 ppm/C; Value_Code: 10k0; Value: 10.0k; EIA_Code: E96; Res_ohm: 10k; SizeX_mm: 1; SizeY_mm: 0.5; SizeZ_mm: 0.6; Value2: 0.063W; AEC Qualified: Y; VDC_V: 50V; AEC Category: Q200; AEC Grade: 0; Supplier Part Number 2: 52K6595; Supplier 2: Newark; Supplier Part Number 3: 71-CRCW0402-10K-E3; Supplier 3: Mouser; RoHS: E; Value1: 1%; MountType: SMT; Supplier 1: Digi-Key; PackageReference: 0402; Tolerance_%: 1%; SizeArea_mm2: 0.5; CompType: Resistor; PartNumber: CRCW040210K0FKED; ComponentLink1Description: Datasheet link; Supplier Part Number 1: 541-10.0KLCT-ND; Technology: Thick Film; ComponentLink1URL: http://www.vishay.com/docs/20035/dcrcwe3.pdf
R73 R96 = CMP-0025884-3: RES, 0, 5%, 0.125 W, 0603; Manufacturer: Vishay/Beyschlag; Power_W: 125mW; TempCo: ppm/C; Value_Code: 0000; U/M: EA; Value: 0; EIA_Code: E24; SizeX_mm: 1.6; SizeY_mm: 0.8; SizeZ_mm: 1; Value2: 0.125W; SizeArea_mm2: 1.28; AEC Qualified: N; AEC Category: Q200; Supplier Part Number 2: 96Y9454; Publisher: Texas Instruments; Supplier 2: Newark; Supplier Part Number 3: 594-MCT06030Z0000ZP5; Supplier 3: Mouser; Published: 2008-06-26; RoHS: Y; Value1: 5%; MountType: SMT; Supplier 1: Digi-Key; PackageReference: 0603; Tolerance_%: 5%; Res_ohm: 0; CompType: Resistor; LatestRevisionDate: 2017-03-09; PartNumber: MCT06030Z0000ZP500; ComponentLink1Description: Datasheet link; AEC Grade: N/A; Supplier Part Number 1: MCT0603-0.0-ZZCT-ND; Technology: Thin Film; ComponentLink1URL: http://www.vishay.com/docs/28705/mcx0x0xpro.pdf
TP4-TP7 TP9-TP11 TP14 = CMP-0003825-1: 1mm Test Point, SMT; Manufacturer: Any; CompType: Test Point; PackageReference: 1mm Test Point, SMT; Publisher: Texas Instruments; LatestRevisionDate: 2017-03-09; ComponentLink1Description: Datasheet Link; ComponentLink1URL: https://sps06.itg.ti.com/sites/KMS/crossdivteams/altium/docs/ComponentDatasheets/PROBE_TEST_POINT.png; Key: TP_SM_1MM; MountType: SMT; PartNumber: TP_SM_1MM
U3 = CMP-0083823-1: 4-A + 2.5-A + Two 1.5-A Buck Converters With Integrated Switches, RNF0026C (VQFN-HR-26); Alternate PartNumber: LP87524PRNFRQ1; Alternate Manufacturer: Texas Instruments; SizeAreaWB_mm2: 27.5; Rating: Automotive; SizeZ_mm: 0.9; SizeX_mm: 4; SizeY_mm: 4.5; SizeArea_mm2: 18; CompType: IC; AEC Qualified: Y; AEC Category: Q200; ComponentLink1URL: http://www.ti.com/lit/ds/symlink/lp87524-q1.pdf; PackageDescription: VQFN-HR-26; MountType: SMT; ComponentLink2URL: http://www.ti.com/product/lp87524-q1; ComponentLink3Description: Online Datasheet; ComponentLink2Description: Product Folder; Manufacturer: Texas Instruments; ComponentLink3URL: http://www.ti.com/product/lp87524-q1/datasheet; PackageReference: RNF0026C; PartNumber: LP87524PRNFTQ1; ComponentLink1Description: Datasheet Link